# Altium project DIOT_template.PrjPCB (part 1 of 2)
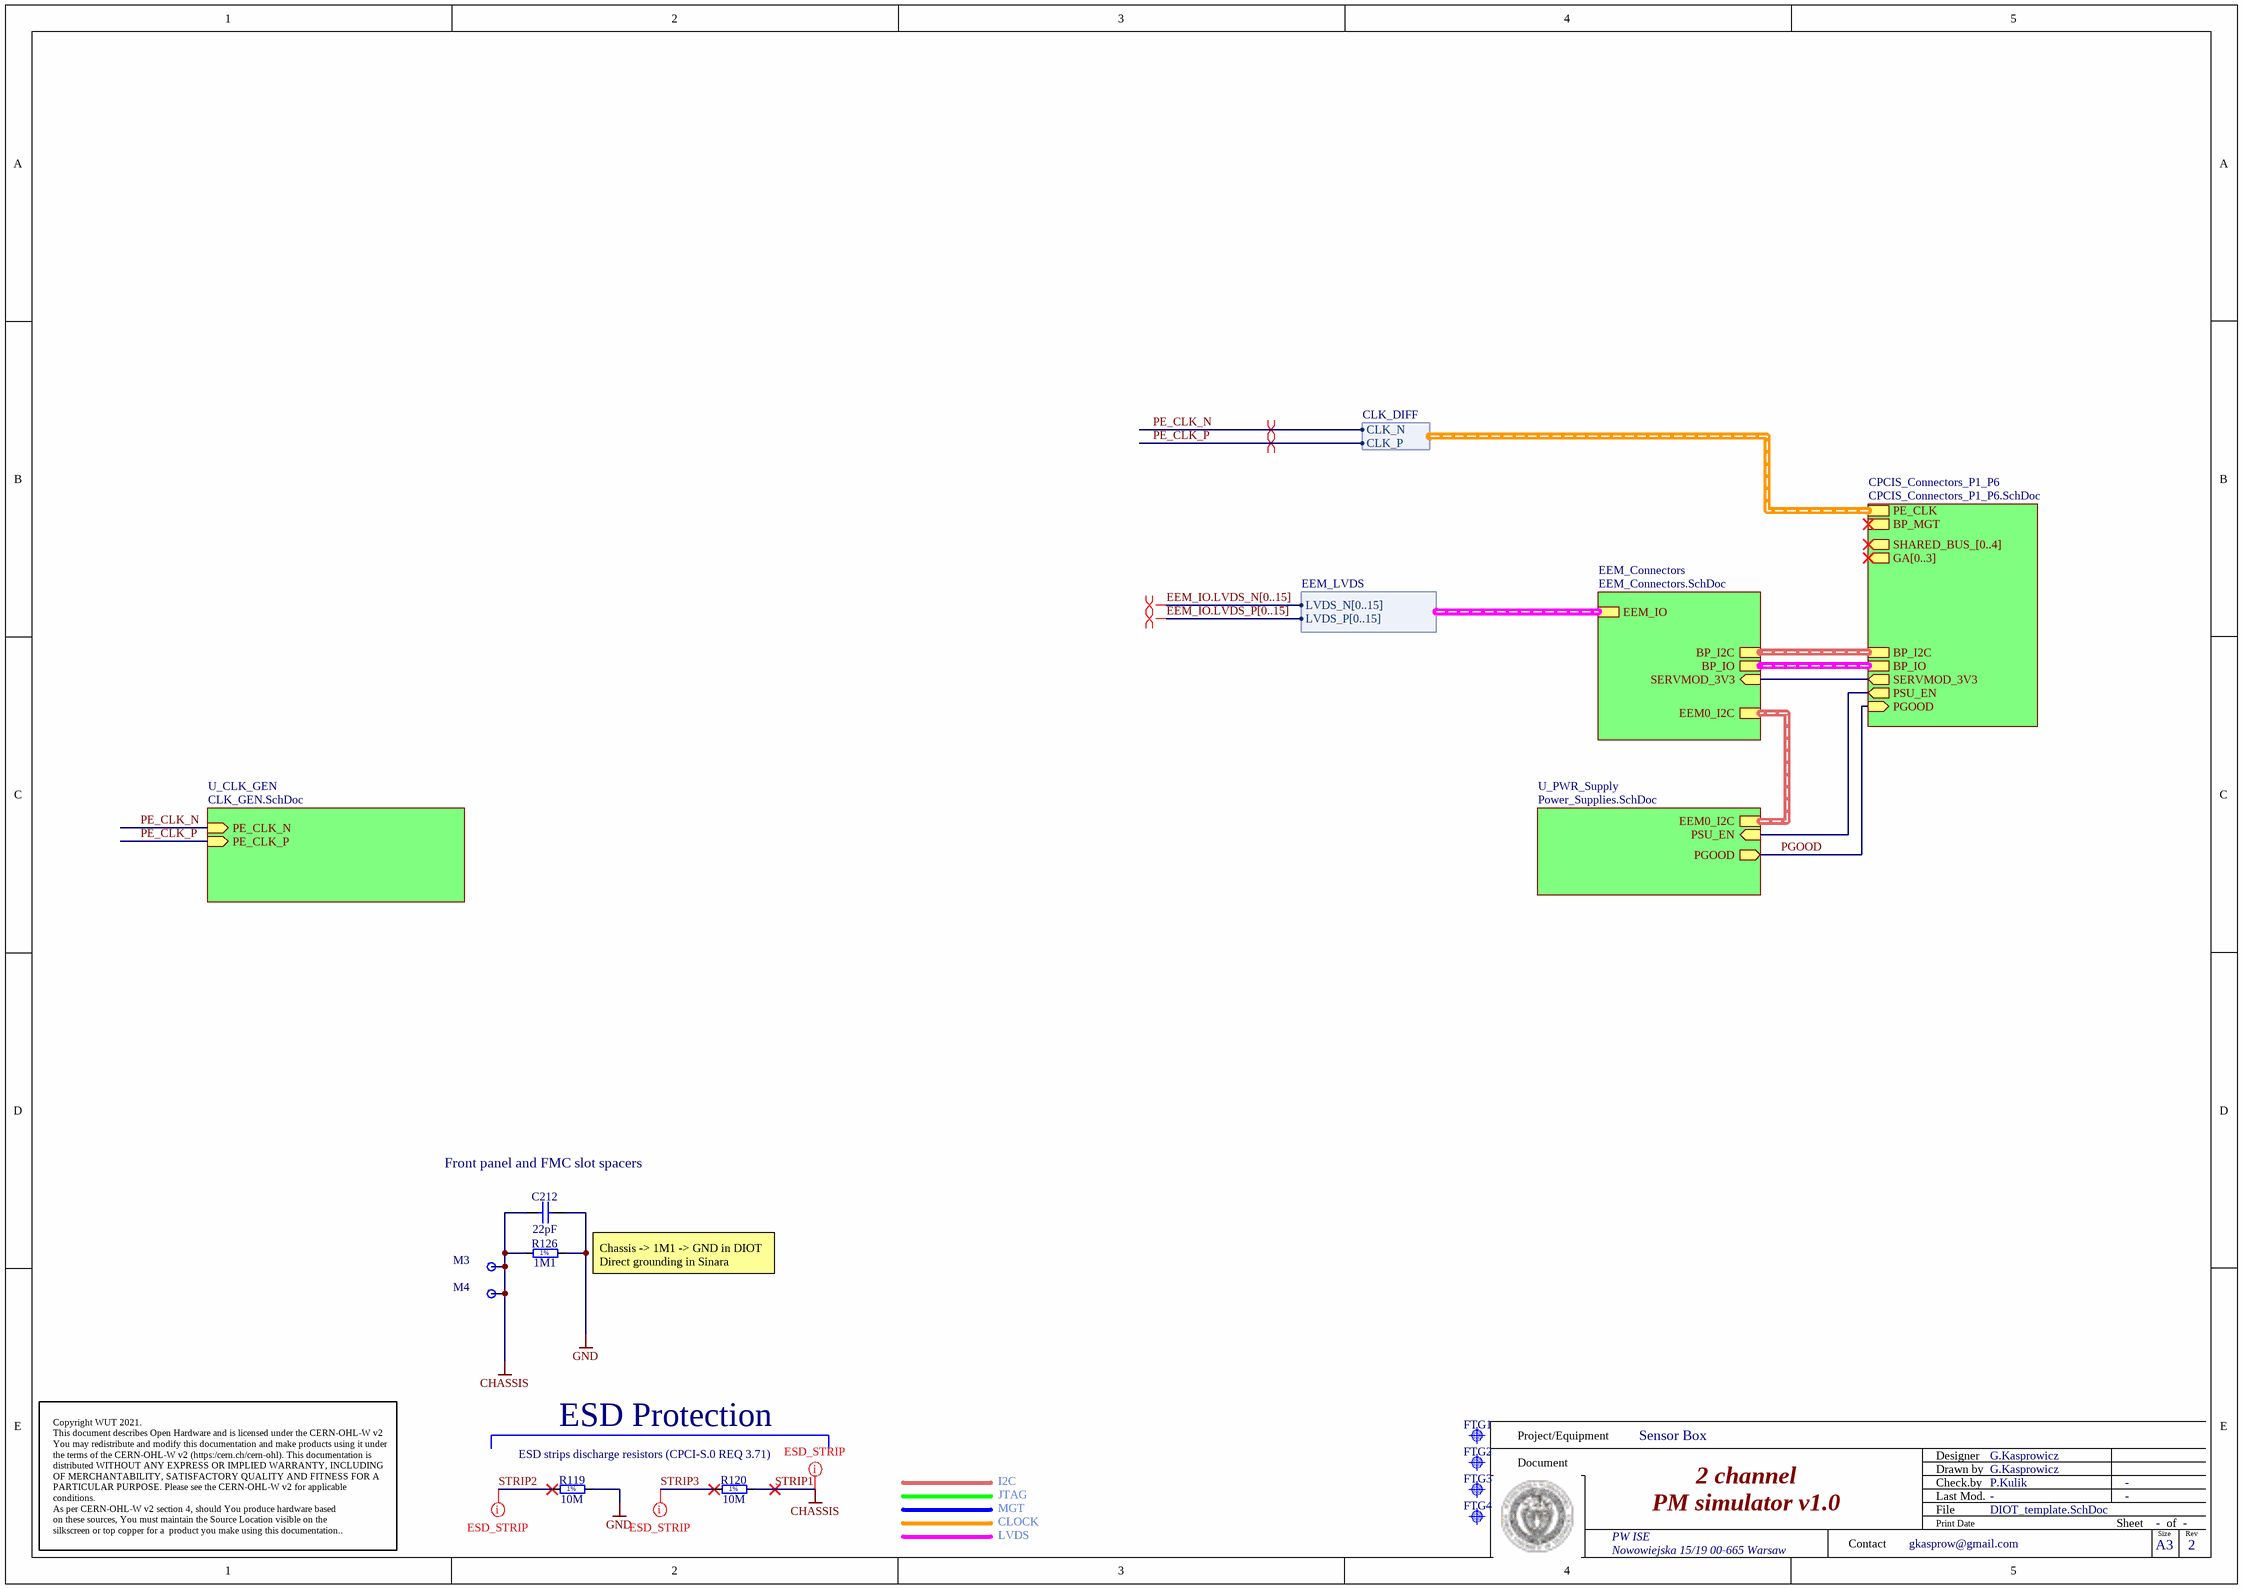
[diagram p0: DIOT_template.SchDoc]
Version: 1.1; Title: EEM FMC Carrier; SheetTotal: 12; P_version: 1.1; Projet: ARTIQ/Sinara; Project1: EEM FMC Carrier; DrawnBy: Paweł Kulik; DivGrp: ISE; Designer: Paweł Kulik; CheckedDate: -; CheckedBy: -; Address3: pawel.kulik@pw.edu.pl; Address2: Nowowiejska 15/19 00-665 Warsaw; Address1: Warsaw University of Technology
4 sheets, 146 parts. Net scope: hierarchical (ports join the sheet entries above them; power ports are global).
Board file: DIOT_template.PcbDoc
Sheets:
  DIOT_template.SchDoc
    U_PWR_Supply = Power_Supplies.SchDoc
    CPCIS_Connectors_P1_P6 = CPCIS_Connectors_P1_P6.SchDoc
    EEM_Connectors = EEM_Connectors.SchDoc

## Sheet DIOT_template.SchDoc: 2 channel
size 420 x 297 mm; EDA_Number: ARTIQ; Projet: ARTIQ/Sinara; CheckedBy: P.Kulik; Author: G.Kasprowicz; CompanyName: WUT ISE; DrawnBy: G.Kasprowicz; Organization: WUT ISE; Address1: PW ISE; Address2: Nowowiejska 15/19 00-665 Warsaw; Address3: gkasprow@gmail.com; Revision: 2; SheetNumber: -; SheetTotal: -; ModifiedBy: -; CheckedDate: -; Title2: PM simulator v1.0; DivGrp: WUT ISE; Designer: G.Kasprowicz; ModifiedDate: -; ProjectName: Sensor Box

### Parts
C212  22pF  [CAPC1005X55N]
FTG1  Use only in PCB  [FIDUCIAL_TOP_C100-200]  (value not drawn)
FTG2  Use only in PCB  [FIDUCIAL_TOP_S100-200]  (value not drawn)
FTG3  Use only in PCB  [FIDUCIAL_TOP_S100-200]  (value not drawn)
FTG4  Use only in PCB  [FIDUCIAL_TOP_S100-200]  (value not drawn)
M3  Plated Hole  [MTG300_600]  (value not drawn)  (no BOM)
M4  Plated Hole  [MTG300_600]  (value not drawn)  (no BOM)
R119  10M  [RESC2113X55N]
R120  10M  [RESC2113X55N]
R126  1M1  [RESC2012X60N]

### Sub-sheets
CPCIS_Connectors_P1_P6 = CPCIS_Connectors_P1_P6.SchDoc: BP_I2C (harness I2C), SERVMOD_3V3 (out), PSU_EN (out), PE_CLK (harness CLK_DIFF), BP_MGT (harness MGT), GA[0..3] (out), BP_IO (harness EEM_LVDS), SHARED_BUS_[0..4] (out), PGOOD (in)
EEM_Connectors = EEM_Connectors.SchDoc: EEM_IO (harness EEM_LVDS), BP_IO (harness EEM_LVDS), EEM0_I2C (harness I2C), BP_I2C (harness I2C), SERVMOD_3V3 (in)
U_CLK_GEN = CLK_GEN.SchDoc (file not in this document): PE_CLK_N (in), PE_CLK_P (in)
U_PWR_Supply = Power_Supplies.SchDoc: PSU_EN (in), EEM0_I2C (harness I2C), PGOOD (out)

### Harnesses
EEM_LVDS: LVDS_P[0..15], LVDS_N[0..15]
CLK_DIFF: CLK_N, CLK_P

### Nets
GND: C212.2 R119.2 R126.2
STRIP1: C212.1 M3.1 M4.1 R120.2 R126.1  [also labelled CHASSIS]
PE_CLK_N: sheet U_CLK_GEN/PE_CLK_N, sheet CPCIS_Connectors_P1_P6/PE_CLK.CLK_N  [project net PE_CLK.CLK_N]
PE_CLK_P: sheet U_CLK_GEN/PE_CLK_P, sheet CPCIS_Connectors_P1_P6/PE_CLK.CLK_P  [project net PE_CLK.CLK_P]
PGOOD: sheet U_PWR_Supply/PGOOD, sheet CPCIS_Connectors_P1_P6/PGOOD
PSU_EN: sheet U_PWR_Supply/PSU_EN, sheet CPCIS_Connectors_P1_P6/PSU_EN
SERVMOD_3V3: sheet CPCIS_Connectors_P1_P6/SERVMOD_3V3, sheet EEM_Connectors/SERVMOD_3V3
STRIP2: R119.1
STRIP3: R120.1

### Buses and harness runs
bus EEM_IO.LVDS_N[0..15]
bus EEM_IO.LVDS_P[0..15]
harness sheet CPCIS_Connectors_P1_P6/BP_I2C = sheet EEM_Connectors/BP_I2C
harness sheet CPCIS_Connectors_P1_P6/BP_IO = sheet EEM_Connectors/BP_IO
harness sheet EEM_Connectors/EEM0_I2C = sheet U_PWR_Supply/EEM0_I2C

### Layout directives
net class ESD_STRIP: STRIP1, STRIP2, STRIP3
differential pair; differential pair class Diff_100Ohm: (no net found under the mark), PE_CLK.CLK_N, PE_CLK.CLK_P

### Notes on the sheet
- (near C212) Front panel and FMC slot spacers
- Chassis -> 1M1 -> GND in DIOT
  Direct grounding in Sinara
- ESD strips discharge resistors (CPCI-S.0 REQ 3.71)
- ESD Protection
- I2C
- JTAG
- MGT
- CLOCK
- LVDS
- Project/Equipment
- Document
- Designer
- Drawn by
- Check.by
- Contact
- File
- Last Mod.
- Print Date
- Sheet
- Size
- A3
- of
- Rev
- Copyright WUT 2021.
  This document describes Open Hardware and is licensed under the CERN-OHL-W v2
  You may redistribute and modify this documentation and make products using it under the terms of the CERN-OHL-W v2 (https:/cern.ch/cern-ohl). This documentation is distributed WITHOUT ANY EXPRESS OR IMPLIED WARRANTY, INCLUDING OF MERCHANTABILITY, SATISFACTORY QUALITY AND FITNESS FOR A PARTICULAR PURPOSE. Please see the CERN-OHL-W v2 for applicable conditions.
  As per CERN-OHL-W v2 section 4, should You produce hardware based
  on these sources, You must maintain the Source Location visible on the
  silkscreen or top copper for a  product you make using this documentation..
- (in symbol R0805_1M1_1%_0.125W_100PPM) 1%
- (in symbol R0805_10M_1%_0.125W_100PPM_VISHAY_CRCW e3) 1%

### Library data of the parts
C212 = CC0402_22PF_50V_5%_C0G: Non-polarised capacitor; Part Description: SMD Multilayer Chip Ceramic Capacitor; Manufacturer: GENERIC; Manufacturer1 Part Number: C0402C220J5GACTU; Voltage: 50V; TC: C0G/NP0; Tolerance: ±5%; Part Number: CC0402_22PF_50V_5%_C0G; Component Kind: Standard; Component Type: Standard; Pin Count: 2; Value: 22pF; Status: Preferred; Manufacturer Part Number: CC0402_22PF_50V_5%_C0G; Case: 0402; Mounted: Yes; Socket: No; SMD: Yes; Manufacturer1 Example: KEMET; Manufacturer1 ComponentHeight: 0.55mm; HelpURL: \\cern.ch\dfs\Applications\Altium\Datasheets\CC0402_C0G_KEMET_(Commercial Grade).pdf; Author: CERN DEM JLC; CreateDate: 2007-12-03; LatestRevisionDate: 2007-12-03; Sense: No
FTG1 = FIDUCIAL_TARGET_C100-200: Fiducial Target; Part Description: Round Fiducial Target, Top Layer, 1.0mm, Top Solder 2.0mm, Keepout =2.0mm; Mounted: No; Part Number: FIDUCIAL_TARGET_C100-200; Component Kind: Standard (No BOM); Component Type: Standard (No BOM); Pin Count: 1; Family: Fiducial; Socket: No; SMD: Yes; Sense: No; Status: None; ComponentHeight: 0mm; HelpURL: Undefined; Author: CERN DEM JLC; CreateDate: 09.02.2010; LatestRevisionDate: 04.04.2012; PackageDescription: Round Fiducial Target, Top Layer, 1.0mm, Top Solder 2.0mm, Keepout =2.0mm
FTG2-FTG4 = FIDUCIAL_TARGET_S100-200: Fiducial Target; Part Description: Square Fiducial Target, Top Layer, 1.0mm, Top Solder 2.0mm, Keepout =2.0mm; Mounted: No; Part Number: FIDUCIAL_TARGET_S100-200; Component Kind: Standard (No BOM); Component Type: Standard (No BOM); Pin Count: 1; Family: Fiducial; Socket: No; SMD: Yes; Sense: No; Status: None; ComponentHeight: 0mm; HelpURL: Undefined; Author: CERN DEM JLC; CreateDate: 09.02.2010; LatestRevisionDate: 04.04.2012; PackageDescription: Square Fiducial Target, Top Layer, 1.0mm, Top Solder 2.0mm, Keepout =2.0mm
M3 M4 = PLATED_HOLE3.0_PAD6.0: Single Terminal Socket; Part Description: Plated Through Hole: Hole Dia.=3.0mm Pad Dia.=6.0mm; Mounted: No; Table: Pads; Part Number: PLATED_HOLE3.0_PAD6.0; Component Type: Standard (No BOM); Designator: Single Terminal Socket; Library Reference: Single Terminal Socket; Pin Count: 1; Family: Plated Hole; Socket: No; SMD: No; Status: None; ComponentHeight: 0mm; Author: CERN DEM JLC; CreateDate: 26.05.2008; LatestRevisionDate: 26.05.2008; PackageDescription: Plated Through Hole: Hole Dia.=3.0mm Pad Dia.=6.0mm
R119 R120 = R0805_10M_1%_0.125W_100PPM_VISHAY_CRCW e3: Resistor - 1%; Part Description: 150V, Standard Thick Film Chip Resistor; Manufacturer: VISHAY DALE; Manufacturer Part Number: CRCW080510M0FKEA; Power: 0.125W; TC: ±100ppm/°C; PressFit: No; Part Number: R0805_10M_1%_0.125W_100PPM_VISHAY_CRCW e3; Component Kind: Standard; Component Type: Standard; Pin Count: 2; Value: 10M; Status: None; Tolerance: ±1%; Case: 0805; Mounted: Yes; Sense: No; Socket: No; SMD: Yes; ComponentHeight: 0.5mm; HelpURL: \\cern.ch\dfs\Applications\Altium\Datasheets\R0805_VISHAY_CRCW e3.pdf; Author: CERN DEM BC; CreateDate: 2019-11-12; LatestRevisionDate: 2019-11-12
R126 = R0805_1M1_1%_0.125W_100PPM: Resistor - 1%; Part Description: General Purpose Thick Film Chip Resistor; Manufacturer: GENERIC; Manufacturer1 Part Number: NRC10F1104TRF; PressFit: No; Part Number: R0805_1M1_1%_0.125W_100PPM; Component Kind: Standard; Component Type: Standard; Pin Count: 2; Value: 1M1; Status: Preferred; Manufacturer Part Number: R0805_1M1_1%_0.125W_100PPM; Case: 0805; Mounted: Yes; Sense: No; Socket: No; SMD: Yes; Manufacturer1 Example: NIC COMPONENT; Manufacturer1 ComponentHeight: 0.6mm; HelpURL: \\cern.ch\dfs\Applications\Altium\Datasheets\R0805_NIC_NRC.pdf; Author: CERN DEM JLC; CreateDate: 03/12/2007; LatestRevisionDate: 13/03/2008

## Sheet Power_Supplies.SchDoc: Power supply
size 420 x 297 mm; EDA_Number: ARTIQ; Projet: ARTIQ/Sinara; CheckedBy: P.Kulik; Author: G.Kasprowicz; CompanyName: WUT ISE; DrawnBy: G.Kasprowicz; Organization: WUT ISE; Address1: PW ISE; Address2: Nowowiejska 15/19 00-665 Warsaw; Address3: gkasprow@gmail.com; Revision: 2; SheetNumber: -; SheetTotal: -; ModifiedBy: -; CheckedDate: -; DivGrp: WUT ISE; Designer: G.Kasprowicz; ModifiedDate: -; ProjectName: Sensor Box
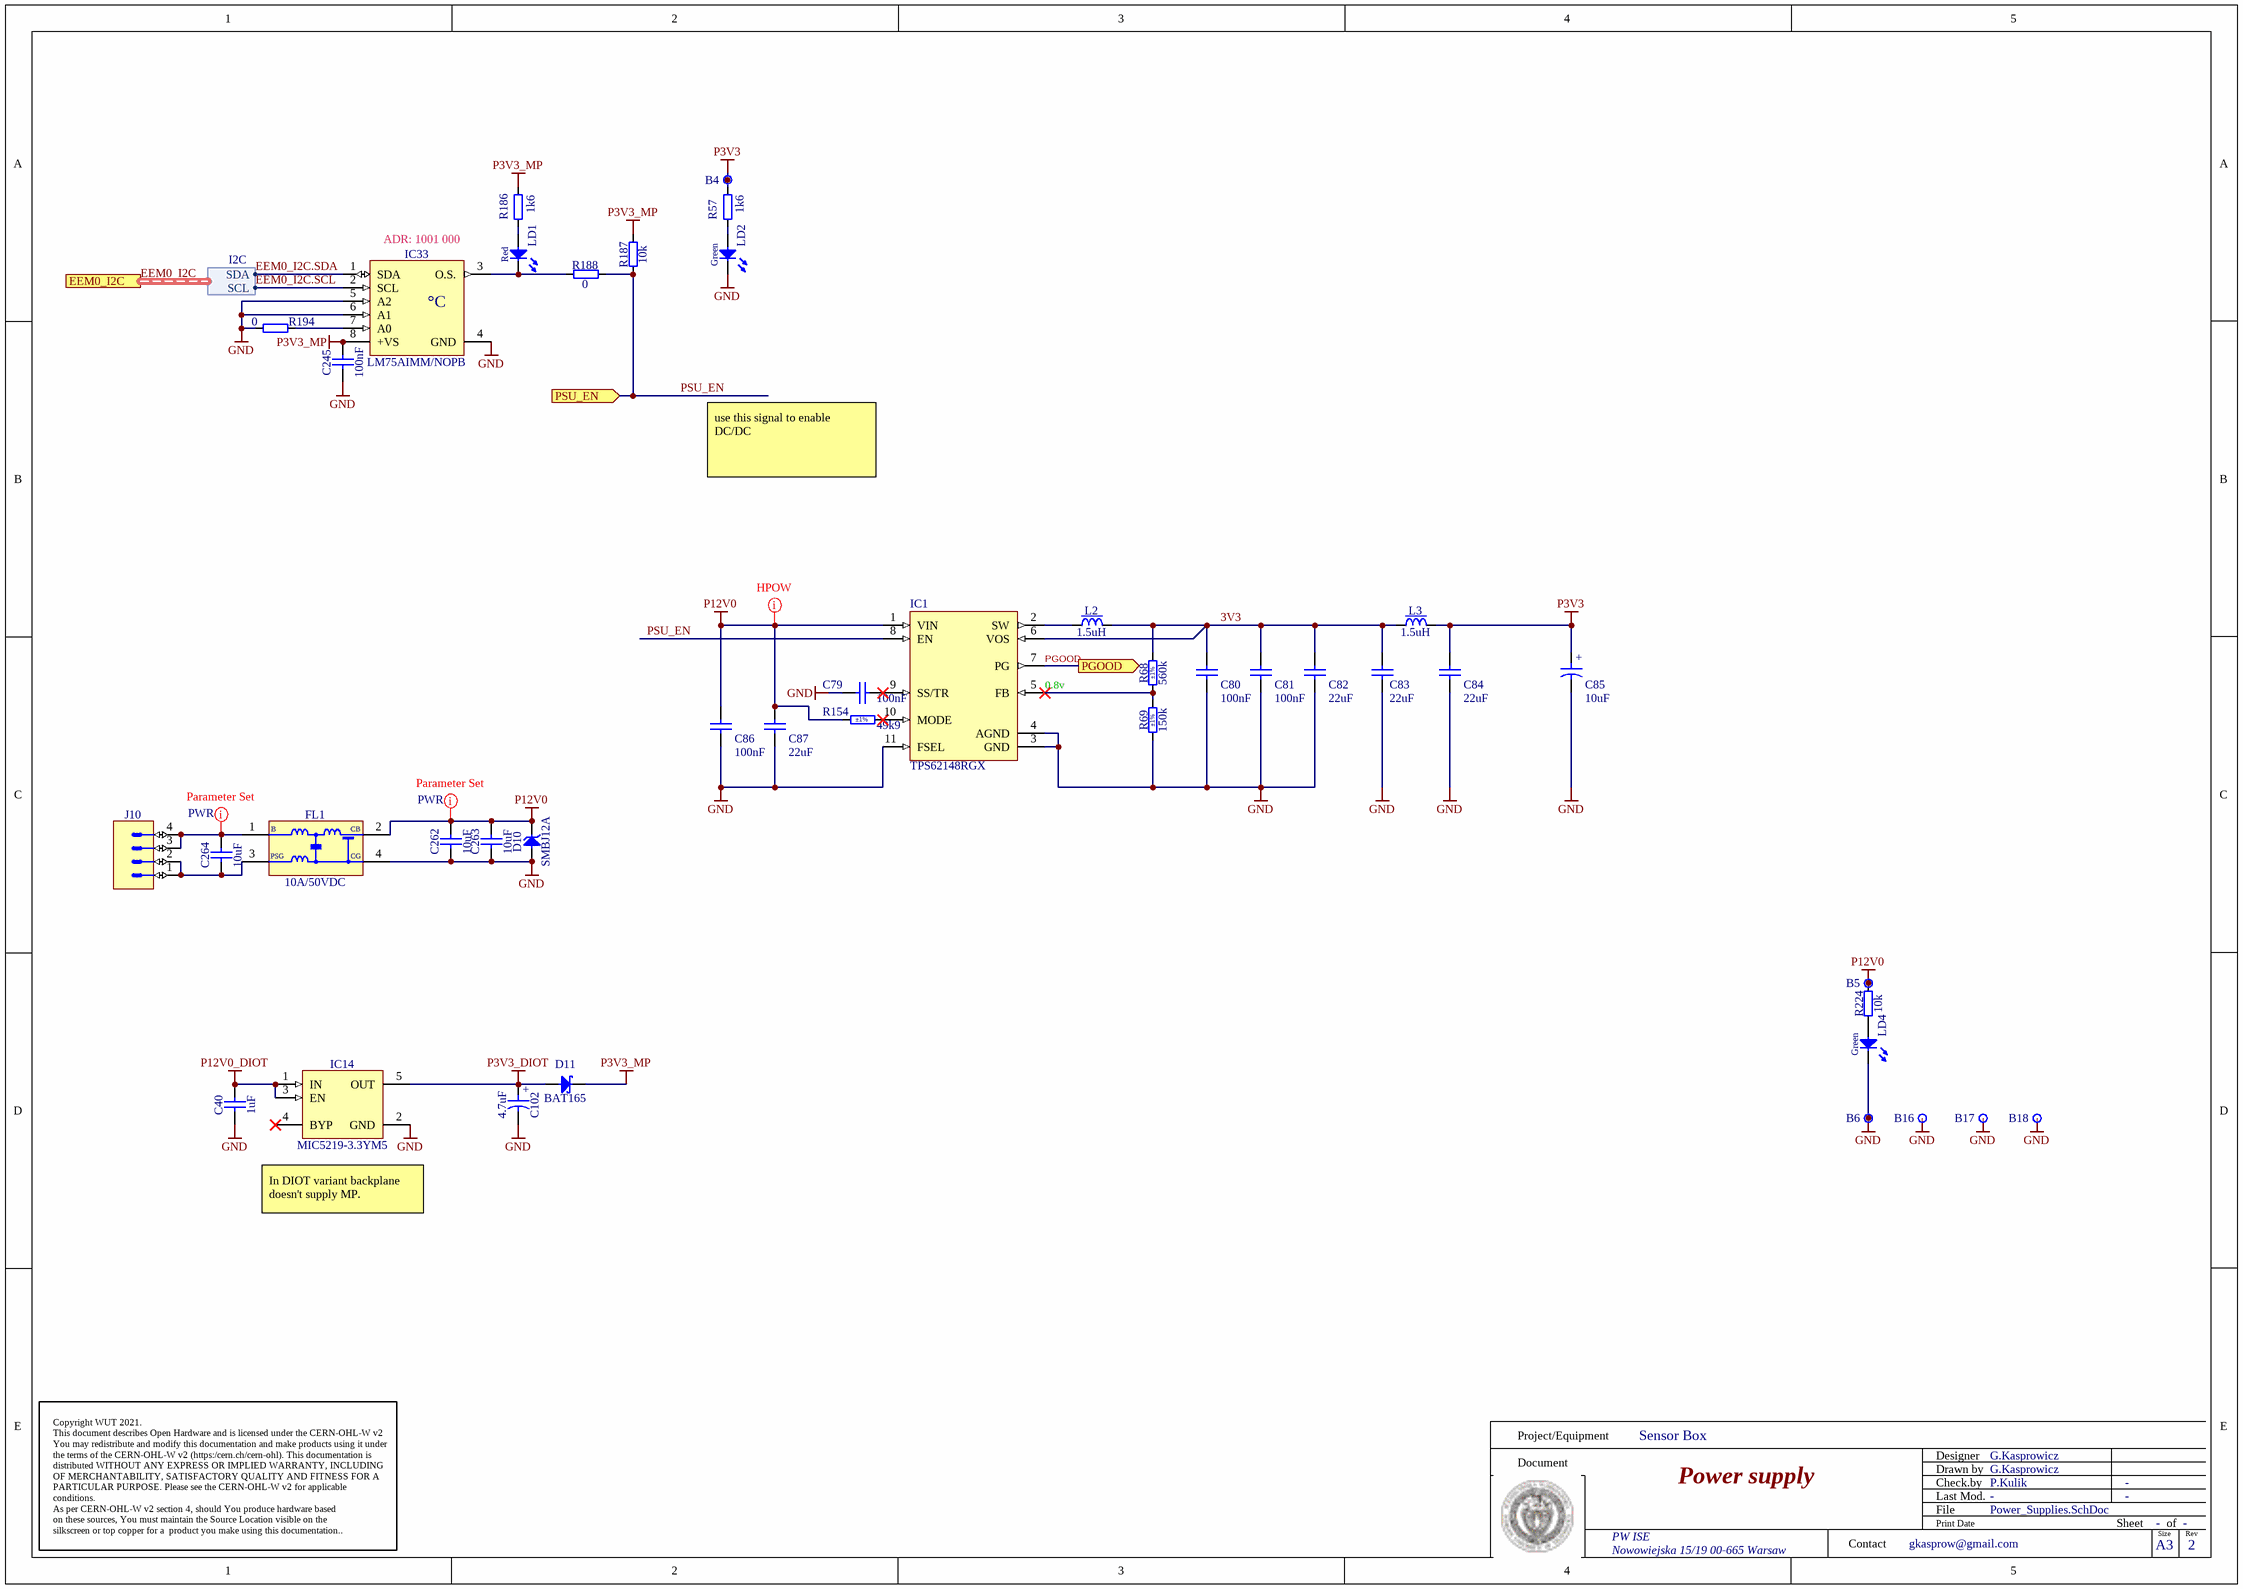
[diagram p1: Power_Supplies.SchDoc]

### Parts
B4  Plated Hole  [c150h50]  (value not drawn)  (no BOM)
B5  Plated Hole  [c150h50]  (value not drawn)  (no BOM)
B6  Plated Hole  [c150h50]  (value not drawn)  (no BOM)
B16  Plated Hole  [c150h50]  (value not drawn)  (no BOM)
B17  Plated Hole  [c150h50]  (value not drawn)  (no BOM)
B18  Plated Hole  [c150h50]  (value not drawn)  (no BOM)
C40  1uF  [CAPC1608X87N]
C79  100nF  [CAPC1005X55N]
C80  100nF  [CAPC1005X55N]
C81  100nF  [CAPC1005X55N]
C82  22uF  [CAPC2012X135N]
C83  22uF  [CAPC2012X135N]
C84  22uF  [CAPC2012X135N]
C85  10uF  [CAPMP3216X180N]
C86  100nF  [CAPC1005X55N]
C87  22uF  [CAPC2012X135N]
C102  4.7uF  [CAPMP3216X180N]
C245  100nF  [CAPC1005X55N]
C262  10uF  [CAPC2012X95N]
C263  10uF  [CAPC2012X95N]
C264  10uF  [CAPC2012X95N]
D10  SMBJ12A  [DIOM5336X265N]
D11  BAT165  [SOD2512X110N]
FL1  10A/50VDC  [FIL_MURATA_BNX02]
IC1  TPS62148RGX  [TEXAS_RGX0011A]
IC14  MIC5219-3.3YM5  [SOT95P280X145-5N]
IC33  LM75AIMM/NOPB  [SOP65P490X109-8N]
J10  Mini-Fit Jr.™  [MOLEX_39-30-0040]  (value not drawn)
L2  1.5uH  [IND_WURTH_WE-LHMI_7050]
L3  1.5uH  [IND_WURTH_WE-LHMI_7050]
LD1  Red  [LED_AVAGO_HSMC-C110]
LD2  Green  [LED_AVAGO_HSME-C110]
LD4  Green  [LED_AVAGO_HSME-C110]
R57  1k6  [RESC1005X40N]
R68  560k  Tolerance: ±1%  [RESC1608X55N]
R69  150k  Tolerance: ±1%  [RESC1608X55N]
R154  49k9  Tolerance: ±1%  [RESC1608X55N]
R186  1k6  [RESC1005X40N]
R187  10k  [RESC1608X55N]
R188  0  [RESC1005X40N]
R194  0  [RESC1005X40N]
R224  10k  [RESC1608X55N]

### Ports
EEM0_I2C (harness I2C), PGOOD (out), PSU_EN (in)

### Harnesses
I2C: SDA, SCL

### Nets
GND: B6.1 B16.1 B17.1 B18.1 C40.1 C79.1 C80.1 C81.1 C82.1 C83.1 C84.1 C85.2 C86.1 C87.1 C102.2 C245.1 C262.1 C263.1 D10.2(A) FL1.4(CG) IC1.3(GND) IC1.4(AGND) IC1.11(FSEL) IC14.2(GND) IC33.4(GND) IC33.5(A2) IC33.6(A1) LD2.1(C) LD4.1(C) R69.1 R194.1
P3V3: B4.1 C84.2 C85.1 L3.2 R57.2
P3V3_DIOT: C102.1 D11.2(A) IC14.5(OUT)
P3V3_MP: C245.2 D11.1(C) IC33.8(+VS) R186.2 R187.2
P12V0: B5.1 C86.2 C87.2 C262.2 C263.2 D10.1(C) FL1.2(CB) IC1.1(VIN) R154.1 R224.2
P12V0_DIOT: C40.2 IC14.1(IN) IC14.3(EN)
3V3: C80.2 C81.2 C82.2 C83.2 IC1.6(VOS) L2.2 L3.1 R68.2
EEM0_I2C.SCL: IC33.2(SCL) ; port EEM0_I2C.SCL
EEM0_I2C.SDA: IC33.1(SDA) ; port EEM0_I2C.SDA
PGOOD: IC1.7(PG) ; port PGOOD
PSU_EN: IC1.8(EN) R187.1 R188.2 ; port PSU_EN
NetC79_2: C79.2 IC1.9(SS/TR)
NetC264_1: C264.1 FL1.3(PSG) J10.1 J10.2
NetC264_2: C264.2 FL1.1(B) J10.3 J10.4
NetIC1_2: IC1.2(SW) L2.1
NetIC1_5: IC1.5(FB) R68.1 R69.2
NetIC1_10: IC1.10(MODE) R154.2
NetIC33_3: IC33.3(O.S.) LD1.1(C) R188.1
NetIC33_7: IC33.7(A0) R194.2
NetLD1_2: LD1.2(A) R186.1
NetLD2_2: LD2.2(A) R57.1
NetLD4_2: LD4.2(A) R224.1

Not connected (* = marked no-connect by the designer): IC14 4(BYP)*

### Buses and harness runs
harness EEM0_I2C = port EEM0_I2C

### Layout directives
net class PWR: NetC264_2, P12V0
net class HPOW: P12V0

### Notes on the sheet
- (near IC33) ADR: 1001 000
- use this signal to enable DC/DC
- (near IC1) 0.8v
- In DIOT variant backplane doesn't supply MP.
- Project/Equipment
- Document
- Designer
- Drawn by
- Check.by
- Contact
- File
- Last Mod.
- Print Date
- Sheet
- Size
- A3
- of
- Rev
- Copyright WUT 2021.
  This document describes Open Hardware and is licensed under the CERN-OHL-W v2
  You may redistribute and modify this documentation and make products using it under the terms of the CERN-OHL-W v2 (https:/cern.ch/cern-ohl). This documentation is distributed WITHOUT ANY EXPRESS OR IMPLIED WARRANTY, INCLUDING OF MERCHANTABILITY, SATISFACTORY QUALITY AND FITNESS FOR A PARTICULAR PURPOSE. Please see the CERN-OHL-W v2 for applicable conditions.
  As per CERN-OHL-W v2 section 4, should You produce hardware based
  on these sources, You must maintain the Source Location visible on the
  silkscreen or top copper for a  product you make using this documentation..
- (in symbol CTE3216-18_4.7UF_10V_10%_AVX_TPSA475K010T1400) +
- (in symbol CTE3216-18_10UF_16V_20%_AVX_TCJ) +
- (in symbol LM75AIMM/NOPB) °C

### Library data of the parts
B4-B6 B16-B18 = PLATED_HOLE0.5_PAD1.5: Single Terminal Socket; Part Description: Plated Through Hole: Hole Dia.=0.5mm Pad Dia.=1.5mm; Mounted: No; Part Number: PLATED_HOLE0.5_PAD1.5; Component Type: Standard (No BOM); Pin Count: 1; Family: Plated Hole; Socket: No; SMD: No; Sense: No; Status: None; ComponentHeight: 0mm; HelpURL: Undefined; Author: CERN DEM MR; CreateDate: 12.10.2017; LatestRevisionDate: 12.10.2017; PackageDescription: Plated Through Hole: Hole Dia.=0.5mm Pad Dia.=1.5mm
C40 = CC0603_1UF_25V_10%_X7R: Non-polarised capacitor; Part Description: SMD Multilayer Chip Ceramic Capacitor; Manufacturer: GENERIC; Manufacturer1 Part Number: GRM188R71E105KA12D; Voltage: 25V; TC: X7R; Tolerance: ±10%; Part Number: CC0603_1UF_25V_10%_X7R; Component Kind: Standard; Component Type: Standard; Pin Count: 2; Value: 1uF; Status: None; Manufacturer Part Number: CC0603_1UF_25V_10%_X7R; Case: 0603; Mounted: Yes; Socket: No; SMD: Yes; Sense: No; Manufacturer1 Example: MURATA; Manufacturer1 ComponentHeight: 0.9mm; HelpURL: \\cern.ch\dfs\Applications\Altium\Datasheets\CC0603_X7R_MURATA.pdf; Author: CERN DEM JLC; CreateDate: 18.01.2011; LatestRevisionDate: 18.01.2011
C79-C81 C86 C245 = CC0402_100NF_50V_10%_X7R: Non-polarised capacitor; Part Description: SMD Multilayer Chip Ceramic Capacitor; Manufacturer: GENERIC; Manufacturer1 Part Number: GRM155R71H104KE14D; Voltage: 50V; TC: X7R; Tolerance: ±10%; Part Number: CC0402_100NF_50V_10%_X7R; Component Kind: Standard; Component Type: Standard; Pin Count: 2; Value: 100nF; Status: None; Manufacturer Part Number: CC0402_100NF_50V_10%_X7R; Case: 0402; Mounted: Yes; Socket: No; SMD: Yes; Sense: No; Manufacturer1 Example: MURATA; Manufacturer1 ComponentHeight: 0.55mm; HelpURL: \\cern.ch\dfs\Applications\Altium\Datasheets\CC0402_MURATA_GRM155R71H104KE14D.pdf; Author: CERN DEM MR; CreateDate: 30.06.2017; LatestRevisionDate: 30.06.2017
C82-C84 C87 = CC0805_22UF_16V_10%_X5R: Non-polarised capacitor; Part Description: SMD Multilayer Chip Ceramic Capacitor; Manufacturer: GENERIC; Manufacturer1 Part Number: C2012X5R1C226KT; Voltage: 16V; TC: X5R; Tolerance: ±10%; Part Number: CC0805_22UF_16V_10%_X5R; Component Kind: Standard; Component Type: Standard; Pin Count: 2; Value: 22uF; Status: Preferred; Manufacturer Part Number: CC0805_22UF_16V_10%_X5R; Case: 0805; Mounted: Yes; Socket: No; SMD: Yes; Sense: No; Manufacturer1 Example: TDK; Manufacturer1 ComponentHeight: 1.35mm; HelpURL: \\cern.ch\dfs\Applications\Altium\Datasheets\CC0805_X5R_TDK_C.pdf; Author: CERN DEM JLC; CreateDate: 25.10.2012; LatestRevisionDate: 25.10.2012
C85 = CTE3216-18_10UF_16V_20%_AVX_TCJ: Polarised capacitor; Part Description: ESR 0R200 Tantalum Solid Electrolytic Chip Capacitor with Conductive Polymer Electrode; Manufacturer: AVX; Manufacturer Part Number: TCJA106M016R0200; Voltage: 16V; Tolerance: ±20%; Part Number: CTE3216-18_10UF_16V_20%_AVX_TCJ; Component Kind: Standard; Component Type: Standard; Pin Count: 2; Value: 10uF; Status: Preferred; Case: A; Mounted: Yes; Socket: No; SMD: Yes; Sense: No; ComponentHeight: 1.8mm; HelpURL: \\cern.ch\dfs\Applications\Altium\Datasheets\CTE_AVX_TCJ.pdf; Author: CERN DEM JLC; CreateDate: 29.03.2012; LatestRevisionDate: 29.03.2012
C102 = CTE3216-18_4.7UF_10V_10%_AVX_TPSA475K010T1400: Polarised capacitor; Part Description: Low ESR 1R4 Automotive Solid Tantalum Chip Capacitor; Manufacturer: AVX; Voltage: 10V; Tolerance: ±10%; Part Number: CTE3216-18_4.7UF_10V_10%_AVX_TPSA475K010T1400; Component Kind: Standard; Component Type: Standard; Pin Count: 2; Value: 4.7uF; Status: Preferred; Manufacturer Part Number: TPSA475K010T1400; Case: A; Mounted: Yes; Socket: No; SMD: Yes; Sense: No; ComponentHeight: 1.8mm; HelpURL: \\cern.ch\dfs\Applications\Altium\Datasheets\CTE-LESR_AVX_TPS-AUTO.pdf; Author: CERN DEM JLC; CreateDate: 23.01.2018; LatestRevisionDate: 23.01.2018
C262-C264 = CC0805_10UF_25V_10%_X5R: Non-polarised capacitor; Part Description: SMD Multilayer Chip Ceramic Capacitor; Manufacturer: GENERIC; Manufacturer1 Part Number: GRM219R61E106KA12D; Voltage: 25V; TC: X5R; Tolerance: ±10%; Part Number: CC0805_10UF_25V_10%_X5R; Component Kind: Standard; Component Type: Standard; Pin Count: 2; Value: 10uF; Status: Preferred; Manufacturer Part Number: CC0805_10UF_25V_10%_X5R; Case: 0805; Mounted: Yes; Socket: No; SMD: Yes; Sense: No; Manufacturer1 Example: MURATA; Manufacturer1 ComponentHeight: 0.95mm; HelpURL: \\cern.ch\dfs\Applications\Altium\Datasheets\CC0805_X5R_MURATA_GRM.pdf; Author: CERN DEM JLC; CreateDate: 25.10.2012; LatestRevisionDate: 06.09.2016
D10 = SMBJ12A: Zener Diode; Part Description: Uni-Directional Transient Voltage Suppressor Diode; Manufacturer: FAIRCHILD SEMICONDUCTOR; Voltage: 12V; Power: 600W; PressFit: No; Bonding: No; Part Number: SMBJ12A; Component Kind: Standard; Component Type: Standard; Device: SMBJ12A; PackageDescription: DO-214-AA/SMB Diode, Molded Body; 5.34mm L X 3.625mm W X 2.65mm H, IPC Medium Density; Manufacturer Part Number: SMBJ12A; Pin Count: 2; Case: DO-214AA; Mounted: Yes; Socket: No; SMD: Yes; Sense: No; ComponentHeight: 2.65mm; HelpURL: \\cern.ch\dfs\Applications\Altium\Datasheets\SMBJ.pdf; Author: CERN DEM JLC; CreateDate: 10.04.2013; LatestRevisionDate: 10.04.2013
D11 = BAT165: Schottky Diode; Manufacturer: INFINEON; Part Description: Medium Power AF Schottky Diode; Voltage: 40V; Power: 750mA; PressFit: No; Bonding: No; Manufacturer Part Number: BAT165; PackageDescription: Small Outline Diode (SOD-323), 1.70mm W X 1.25mm L X 1.10mm H body,  IPC Medium Density; Part Number: BAT165; Component Kind: Standard; Component Type: Standard; Device: BAT165; Pin Count: 2; Case: SOD323; Mounted: Yes; Socket: No; SMD: Yes; Sense: No; ComponentHeight: 1.1mm; HelpURL: \\cern.ch\dfs\Applications\Altium\Datasheets\BAT165.pdf; Author: CERN DEM JLC; CreateDate: 12.11.2014; LatestRevisionDate: 12.11.2014
FL1 = FIL_MURATA_BNX022-01L: Block Type EMIFIL (LC Combined); Part Description: Block Type EMIFIL (LC Combined) SMD Type, BNX02* Series; Manufacturer: MURATA; Resistance: 0.5R; Part Number: FIL_MURATA_BNX022-01L; Component Kind: Standard; Component Type: Standard; Pin Count: 2; Value: 10A/50VDC; Status: None; Manufacturer Part Number: BNX022-01L; Mounted: Yes; Socket: No; SMD: Yes; Sense: No; ComponentHeight: 3.3mm; HelpURL: \\cern.ch\dfs\Applications\Altium\Datasheets\FIL_MURATA_BNX022-01L.pdf; Author: CERN DEM JLC; CreateDate: 10.10.2012; LatestRevisionDate: 10.10.2012
IC1 = TPS62148RGX: 3V-17V 2A Step-Down Converter, High Accuracy, With DCS-Control; Manufacturer: TEXAS INSTRUMENTS; PressFit: No; Bonding: No; Part Number: TPS62148RGX; Component Kind: Standard; Component Type: Standard; Device: TPS62148RGX; PackageDescription: TEXAS Case Style (R-VQFN-HR-N11), 0.50mm Pitch, 11 Pin, 2.00mm W X 3.00mm L X 1.00mm H body; Part Description: 3V-17V 2A Step-Down Converter, High Accuracy, with DCS-Control; Manufacturer Part Number: TPS62148RGX; Pin Count: 11; Case: QFN14; Mounted: Yes; Socket: No; SMD: Yes; Sense: No; ComponentHeight: 1mm; HelpURL: \\cern.ch\dfs\Applications\Altium\Datasheets\TPS62148RGX.pdf; Author: CERN DEM MR; CreateDate: 08.02.2019; LatestRevisionDate: 08.02.2019
IC14 = MIC5219-3.3YM5: 500mA Peak Output LDO Regulator; Part Description: 3.3V 500mA Peak Output Low Drop-Out  (LDO) Regulator; Manufacturer: MICROCHIP TECHNOLOGY; PressFit: No; Bonding: No; Part Number: MIC5219-3.3YM5; Component Kind: Standard; Component Type: Standard; Device: MIC5219-3.3YM5; PackageDescription: SOT, 0.95mm pitch; 5 pin, 1.60mm W X 2.90mm L X 1.45mm H body, IPC Medium Density; Manufacturer Part Number: MIC5219-3.3YM5; Pin Count: 5; Case: SOT23-5; Mounted: Yes; Socket: No; SMD: Yes; Sense: No; ComponentHeight: 1.45mm; HelpURL: \\cern.ch\dfs\Applications\Altium\Datasheets\MIC5219-3.3YM5.pdf; Author: CERN DEM WB; CreateDate: 2019-04-16; LatestRevisionDate: 2019-04-16
IC33 = LM75AIMM/NOPB: Digital Temperature Sensor and Thermal Watchdog with Two-Wire Interface; Part Description: -25° to +100°C ±2°C Digital Temperature Sensor and Thermal Watchdog with Two-Wire Interface; Manufacturer: TEXAS INSTRUMENTS; PressFit: No; Bonding: No; Part Number: LM75AIMM/NOPB; Component Kind: Standard; Component Type: Standard; Device: LM75AIMM/NOPB; PackageDescription: SOP, 0.65mm pitch; 8 pin,3.00mm W X 3.00mm L X 1.09mm H bodyI, PC Medium Density; Manufacturer Part Number: LM75AIMM/NOPB; Pin Count: 8; Case: SSOP8; Mounted: Yes; Socket: No; SMD: Yes; Sense: No; ComponentHeight: 1.09mm; HelpURL: \\cern.ch\dfs\Applications\Altium\Datasheets\LM75AIMM-NOPB.pdf; Author: CERN DEM JLC; CreateDate: 15.10.2012; LatestRevisionDate: 15.10.2012
J10 = MOLEX_39-30-0040: Connector 4 Male; Part Description: 4.20mm (.165") Pitch Mini-Fit Jr. Header, Dual Row, Right Angle with Snap-in Plastic Peg PCB Lock, 4 Circuits; Manufacturer: MOLEX; PressFit: No; Part Number: MOLEX_39-30-0040; Component Kind: Standard; Component Type: Standard; Pin Count: 4; Family: Mini-Fit Jr.™; Mounted: Yes; Socket: No; SMD: No; Sense: No; Status: None; Manufacturer Part Number: 39-30-0040; ComponentHeight: 11.4mm; HelpURL: \\cern.ch\dfs\Applications\Altium\Datasheets\MOLEX_39-30-0040.pdf; Author: CERN DEM JLC; CreateDate: 2018-10-02; LatestRevisionDate: 2018-10-02
L2 L3 = IND_1.5UH_20%_WURTH_WE-LHMI_74437349015: Inductor With Core; Part Description: SMD Power Inductor (WE-LHMI Series); Manufacturer: WURTH ELEKTRONIK; Power: 8A; Resistance: 0.0086R; Tolerance: ±20%; Part Number: IND_1.5UH_20%_WURTH_WE-LHMI_74437349015; Component Kind: Standard; Component Type: Standard; Pin Count: 2; Value: 1.5uH; Manufacturer Part Number: 74437349015; Mounted: Yes; Socket: No; SMD: Yes; Sense: No; ComponentHeight: 5mm; HelpURL: \\cern.ch\dfs\Applications\Altium\Datasheets\IND_WURTH_WE-LHMI_74437349015.pdf; Author: CERN DEM MR; CreateDate: 27.05.2016; LatestRevisionDate: 27.05.2016
LD1 = LED_AVAGO_HSMC-C110: LED Red 1C 2A; Part Description: High Performance Right Angle Chip Red LED; Manufacturer: AVAGO TECHNOLOGIES; PressFit: No; Bonding: No; Part Number: LED_AVAGO_HSMC-C110; Component Kind: Standard; Component Type: Standard; Color: Red; PackageDescription: Red Chip LED, 2-Leads, Body 3.3x1.6mm, Side Emitting Package; Status: Not Recommended; Manufacturer Part Number: HSMC-C110; Pin Count: 2; Case: 1206; Mounted: Yes; Socket: No; SMD: Yes; Sense: No; ComponentHeight: 1.1mm; HelpURL: \\cern.ch\dfs\Applications\Altium\Datasheets\LED_AVAGO_HSMC-C110.pdf; ComponentLink1URL: \\cern.ch\dfs\Applications\Altium\Datasheets\LED_AVAGO_HSMC-C110_DESIGN-GUIDE.pdf; ComponentLink1Description: Design Guide; Author: CERN DEM JMW; CreateDate: 30.07.2009; LatestRevisionDate: 20.06.2012
LD2 LD4 = LED_AVAGO_HSME-C110: LED Green 1C 2A; Part Description: High Performance Right Angle Chip Green LED; Manufacturer: AVAGO TECHNOLOGIES; PressFit: No; Bonding: No; Part Number: LED_AVAGO_HSME-C110; Component Kind: Standard; Component Type: Standard; Color: Green; PackageDescription: Green Chip LED, 2-Leads, Body 3.3x1.6mm, Side Emitting Package; Status: Not Recommended; Manufacturer Part Number: HSME-C110; Pin Count: 2; Case: 1206; Mounted: Yes; Socket: No; SMD: Yes; Sense: No; ComponentHeight: 1.1mm; HelpURL: \\cern.ch\dfs\Applications\Altium\Datasheets\LED_AVAGO_HSME-C110.pdf; ComponentLink1URL: \\cern.ch\dfs\Applications\Altium\Datasheets\LED_AVAGO_HSME-C110_DESIGN-GUIDE.pdf; ComponentLink1Description: Design Guide; Author: CERN DEM JMW; CreateDate: 30.07.2009; LatestRevisionDate: 20.06.2012
R57 R186 = R0402_1K6_1%_0.0625W_100PPM: Resistor - 1%; Part Description: General Purpose Thick Film Chip Resistor; Manufacturer: GENERIC; Manufacturer1 Part Number: 232270671602L; TC: ±100ppm/°C; PressFit: No; Part Number: R0402_1K6_1%_0.0625W_100PPM; Component Kind: Standard; Component Type: Standard; Pin Count: 2; Value: 1k6; Status: Not Recommended; Power: 0.0625W; Tolerance: ±1%; Manufacturer Part Number: R0402_1K6_1%_0.0625W_100PPM; Case: 0402; Mounted: Yes; Sense: No; Socket: No; SMD: Yes; Manufacturer1 Example: YAGEO PHYCOMP; Manufacturer1 ComponentHeight: 0.4mm; HelpURL: \\cern.ch\dfs\Applications\Altium\Datasheets\R0402_Phycomp_RC0402.pdf; Author: CERN DEM JLC; CreateDate: 03.12.2007; LatestRevisionDate: 17.10.2012
R68 = R0603_560K_1%_0.1W_100PPM: Resistor - 1%; Part Description: General Purpose Thick Film Chip Resistor; Manufacturer: GENERIC; Manufacturer1 Part Number: NRC06F5603TRF; Power: 0.1W; TC: ±100ppm/°C; PressFit: No; Part Number: R0603_560K_1%_0.1W_100PPM; Component Kind: Standard; Component Type: Standard; Pin Count: 2; Value: 560k; Status: Preferred; Manufacturer Part Number: R0603_560K_1%_0.1W_100PPM; Case: 0603; Mounted: Yes; Sense: No; Socket: No; SMD: Yes; Manufacturer1 Example: NIC COMPONENT; Manufacturer1 ComponentHeight: 0.55mm; HelpURL: \\cern.ch\dfs\Applications\Altium\Datasheets\R0603_NIC_NRC.pdf; Author: CERN DEM JLC; CreateDate: 03.12.2007; LatestRevisionDate: 13.03.2008
R69 = R0603_150K_1%_0.1W_100PPM: Resistor - 1%; Part Description: General Purpose Thick Film Chip Resistor; Manufacturer: GENERIC; Manufacturer1 Part Number: NRC06F1503TRF; Power: 0.1W; TC: ±100ppm/°C; PressFit: No; Part Number: R0603_150K_1%_0.1W_100PPM; Component Kind: Standard; Component Type: Standard; Pin Count: 2; Value: 150k; Status: Preferred; Manufacturer Part Number: R0603_150K_1%_0.1W_100PPM; Case: 0603; Mounted: Yes; Sense: No; Socket: No; SMD: Yes; Manufacturer1 Example: NIC COMPONENT; Manufacturer1 ComponentHeight: 0.55mm; HelpURL: \\cern.ch\dfs\Applications\Altium\Datasheets\R0603_NIC_NRC.pdf; Author: CERN DEM JLC; CreateDate: 03.12.2007; LatestRevisionDate: 13.03.2008
R154 = R0603_49K9_1%_0.1W_100PPM: Resistor - 1%; Part Description: General Purpose Thick Film Chip Resistor; Manufacturer: GENERIC; Manufacturer1 Part Number: CRCW060349K9FKEA; Power: 0.1W; TC: ±100ppm/°C; PressFit: No; Part Number: R0603_49K9_1%_0.1W_100PPM; Component Kind: Standard; Component Type: Standard; Pin Count: 2; Value: 49k9; Status: Preferred; Manufacturer Part Number: R0603_49K9_1%_0.1W_100PPM; Case: 0603; Mounted: Yes; Sense: No; Socket: No; SMD: Yes; Manufacturer1 Example: VISHAY; Manufacturer1 ComponentHeight: 0.55mm; HelpURL: \\cern.ch\dfs\Applications\Altium\Datasheets\R0603_VISHAY_CRCW e3.pdf; Author: CERN DEM JLC; CreateDate: 16.11.2017; LatestRevisionDate: 16.11.2017
R187 R224 = R0603_10K_1%_0.1W_100PPM: Resistor - 1%; Part Description: General Purpose Thick Film Chip Resistor; Manufacturer: GENERIC; Manufacturer1 Part Number: NRC06F1002TRF; Power: 0.1W; TC: ±100ppm/°C; PressFit: No; Part Number: R0603_10K_1%_0.1W_100PPM; Component Kind: Standard; Component Type: Standard; Pin Count: 2; Value: 10k; Status: Preferred; Tolerance: ±1%; Manufacturer Part Number: R0603_10K_1%_0.1W_100PPM; Case: 0603; Mounted: Yes; Sense: No; Socket: No; SMD: Yes; Manufacturer1 Example: NIC COMPONENT; Manufacturer1 ComponentHeight: 0.55mm; HelpURL: \\cern.ch\dfs\Applications\Altium\Datasheets\R0603_NIC_NRC.pdf; Author: CERN DEM JLC; CreateDate: 03.12.2007; LatestRevisionDate: 13.03.2008
R188 R194 = R0402_0R_JUMPER: Resistor; Part Description: 1A (0.05R Max DC Resistance) Zero Ohm Jumper; Manufacturer: GENERIC; Manufacturer1 Part Number: 232270591001L; Part Number: R0402_0R_JUMPER; Component Kind: Standard; Component Type: Standard; Pin Count: 2; Value: 0; Status: Not recommended; Manufacturer Part Number: R0402_0R_JUMPER; Case: 0402; Mounted: Yes; Sense: No; Socket: No; SMD: Yes; Manufacturer1 Example: YAGEO PHYCOMP; Manufacturer1 ComponentHeight: 0.4mm; HelpURL: \\cern.ch\dfs\Applications\Altium\Datasheets\R0402_Phycomp_RC0402.pdf; Author: CERN DEM JLC; CreateDate: 03.12.2007; LatestRevisionDate: 17.10.2012

## Sheet CPCIS_Connectors_P1_P6.SchDoc: EEM FMC Carrier
size 420 x 297 mm; CheckedBy: -; DrawnBy: Paweł Kulik; Organization: WUT; Address1: Warsaw University of Technology; Address2: Nowowiejska 15/19 00-665 Warsaw; Address3: pawel.kulik@pw.edu.pl; DocumentNumber: 1; SheetNumber: 10; SheetTotal: 12; Projet: ARTIQ/Sinara; CheckedDate: -; Title2: CPCIS Connectors; DivGrp: ISE; Designer: Paweł Kulik; SPICEModelCacheRMUUFYQV: <root> / <DocumentId>RMUUFYQV</DocumentId> / </root>; ModifiedDate: -; Rule: PcbType=ProtelPcb; ProjectName: DIOT_template.PrjPCB
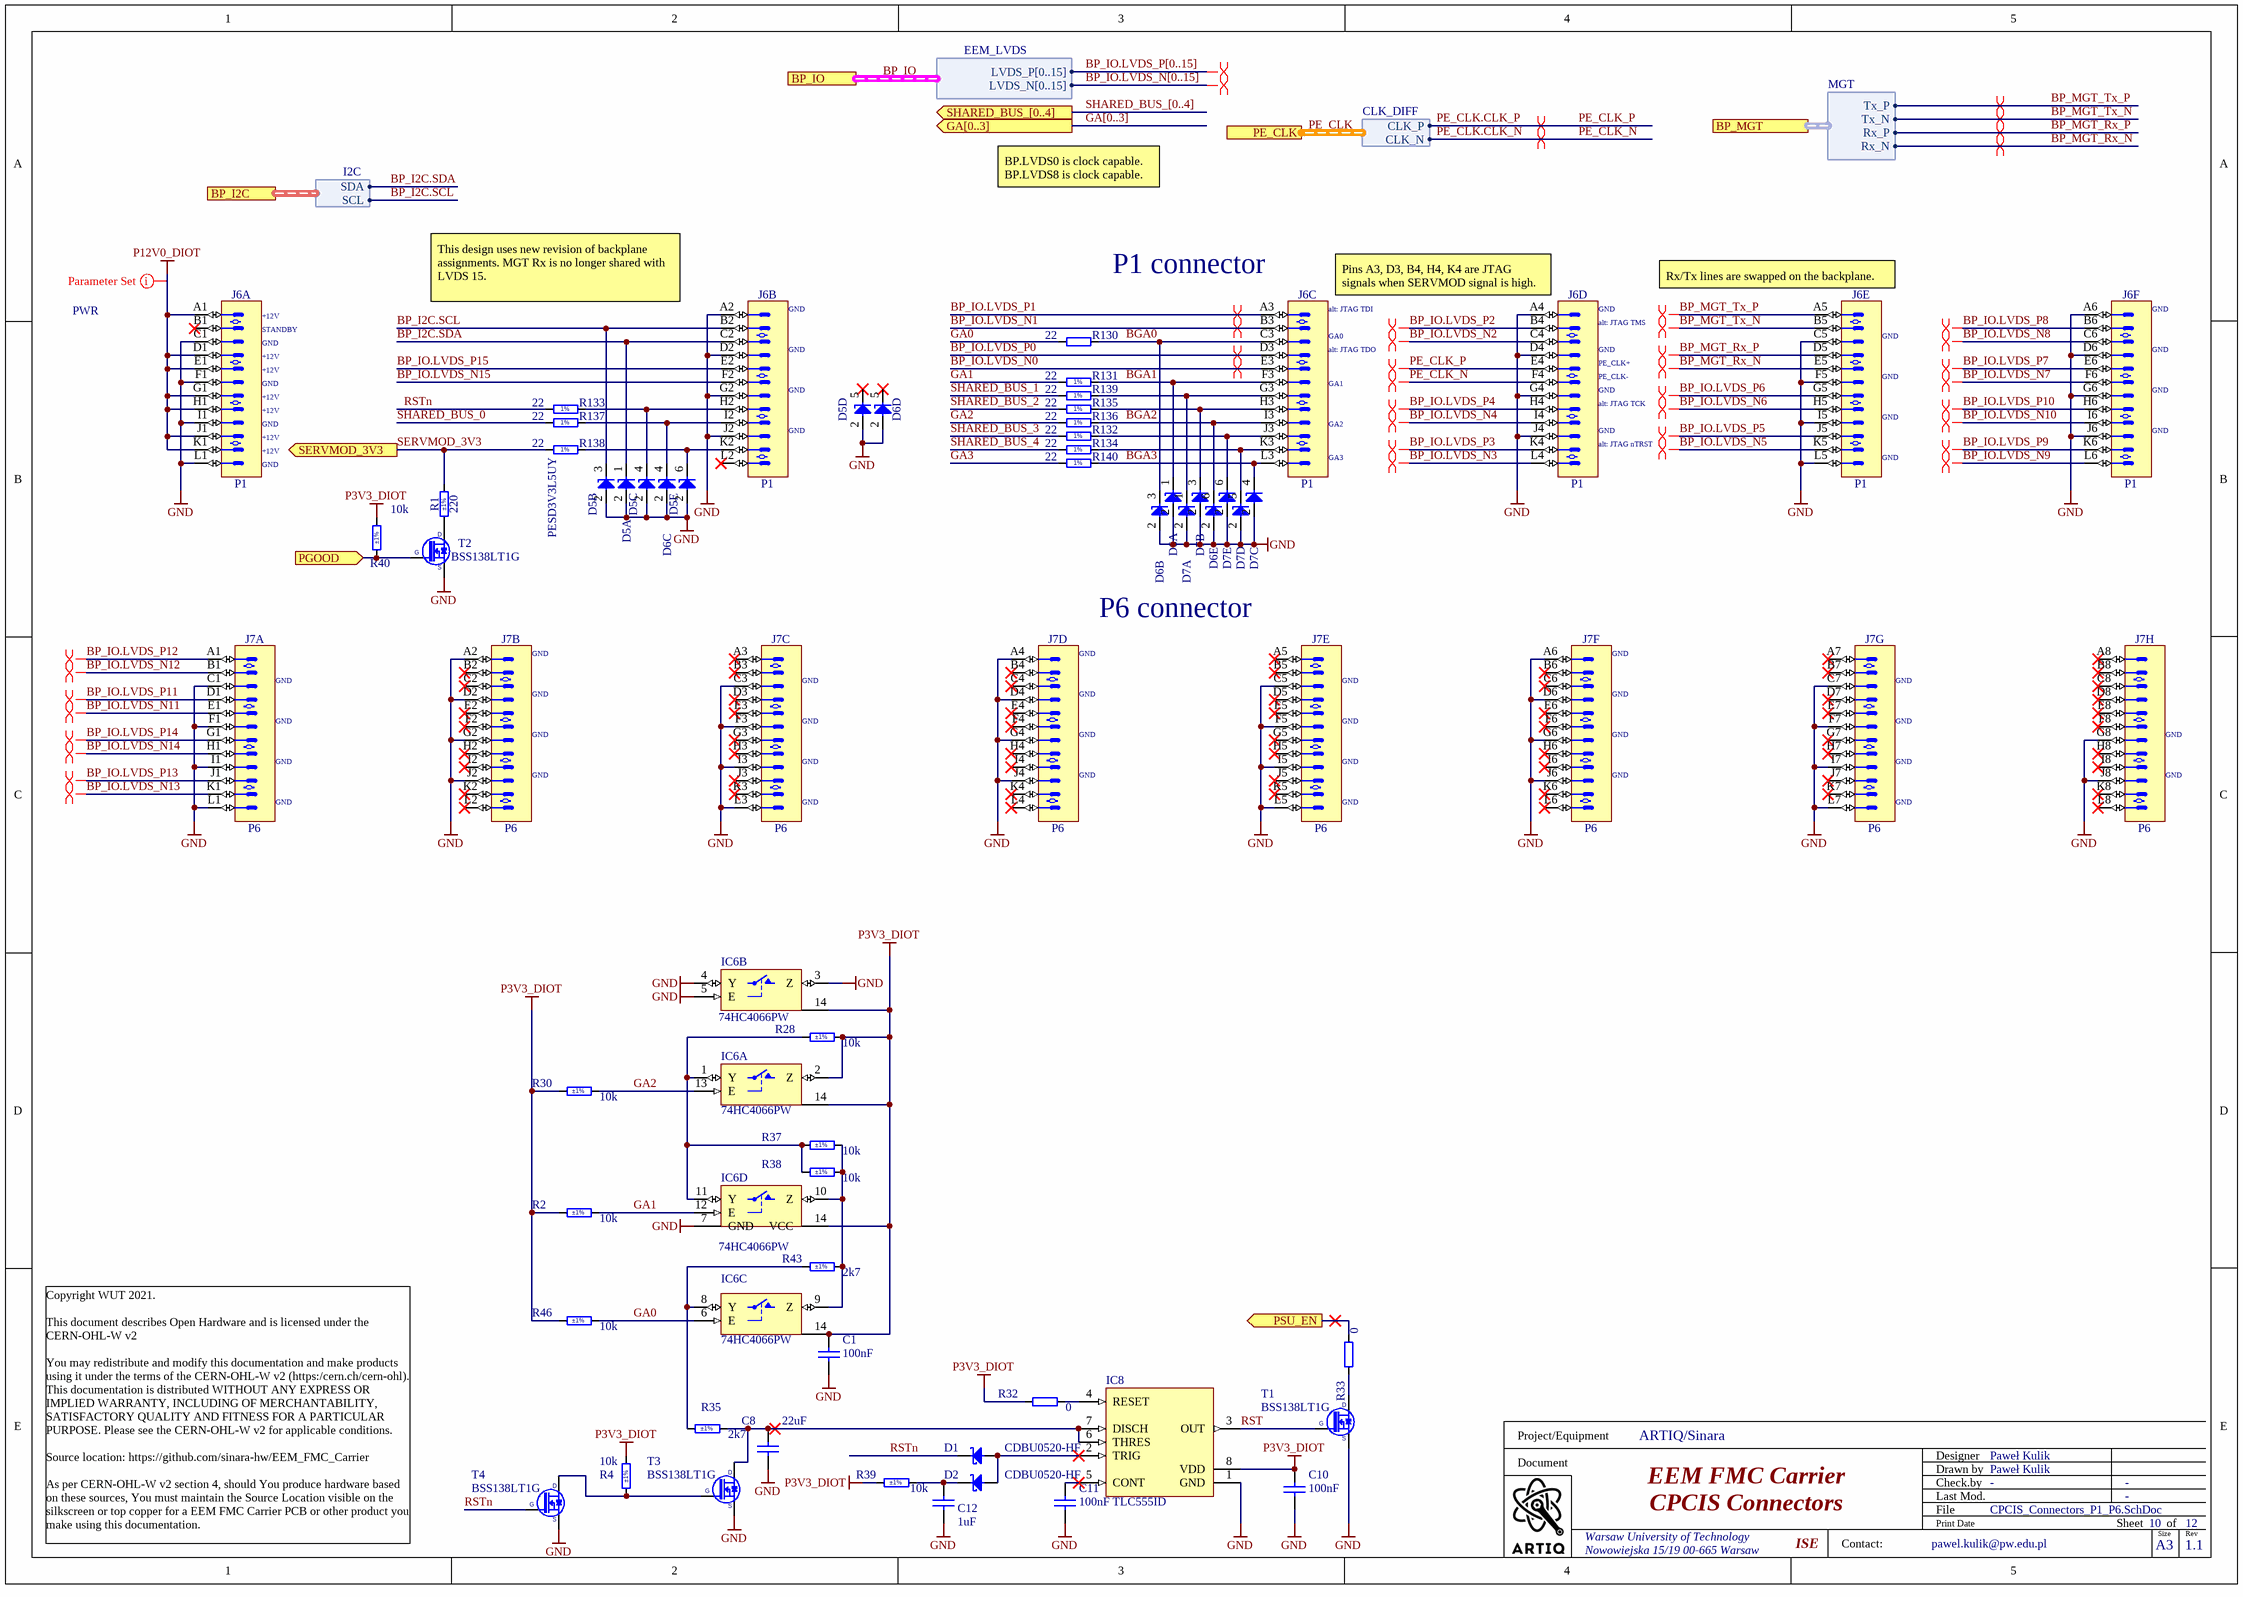
[diagram p2: CPCIS_Connectors_P1_P6.SchDoc]

### Parts
C1  100nF  [CAPC1608X87N]
C8  22uF  [CAPC2012X135N]
C10  100nF  [CAPC1608X87N]
C11  100nF  [CAPC1608X87N]
C12  1uF  [CAPC1608X87N]
D1  CDBU0520-HF  [SOD-523F]
D2  CDBU0520-HF  [SOD-523F]
D5  PESD3V3L5UY  [SOT65P210X110-6N]  (value not drawn)  (parts A,B,C,D,E of 5)
D6  PESD3V3L5UY  [SOT65P210X110-6N]  (value not drawn)  (parts A,B,C,D,E of 5)
D7  PESD3V3L5UY  [SOT65P210X110-6N]  (value not drawn)  (parts A,B,C,D,E of 5)
IC6  74HC4066PW  [SOP65P640X110-14N]  (parts A,B,C,D of 4)
IC8  TLC555ID  [SOIC127P600X175-8N]
J6  P1  [AMPHENOL_10052825-101LF]  (parts A,B,C,D,E,F of 6)
J7  P6  [AMPHENOL_10052838-101LF]  (parts A,B,C,D,E,F,G,H of 8)
R1  220  Tolerance: ±1%  [RESC1005X40N]
R2  10k  Tolerance: ±1%  [RESC1608X55N]
R4  10k  Tolerance: ±1%  [RESC1608X55N]
R28  10k  Tolerance: ±1%  [RESC1608X55N]
R30  10k  Tolerance: ±1%  [RESC1608X55N]
R32  0  [RESC1608X55N]
R33  0  [RESC1608X55N]
R35  2k7  Tolerance: ±1%  [RESC1608X55N]
R37  10k  Tolerance: ±1%  [RESC1608X55N]
R38  10k  Tolerance: ±1%  [RESC1608X55N]
R39  10k  Tolerance: ±1%  [RESC1608X55N]
R40  10k  Tolerance: ±1%  [RESC1608X55N]
R43  2k7  Tolerance: ±1%  [RESC1608X55N]
R46  10k  Tolerance: ±1%  [RESC1608X55N]
R130  22  [RESC1005X40N]
R131  22  [RESC1005X40N]
R132  22  [RESC1005X40N]
R133  22  [RESC1005X40N]
R134  22  [RESC1005X40N]
R135  22  [RESC1005X40N]
R136  22  [RESC1005X40N]
R137  22  [RESC1005X40N]
R138  22  [RESC1005X40N]
R139  22  [RESC1005X40N]
R140  22  [RESC1005X40N]
T1  BSS138LT1G  [SOT95P240X110-3N]
T2  BSS138LT1G  [SOT95P240X110-3N]
T3  BSS138LT1G  [SOT95P240X110-3N]
T4  BSS138LT1G  [SOT95P240X110-3N]

### Ports
BP_I2C (harness I2C), BP_IO (harness EEM_LVDS), BP_MGT (harness MGT), GA[0..3] (out), PE_CLK (harness CLK_DIFF), PGOOD (in), PSU_EN (out), SERVMOD_3V3 (out), SHARED_BUS_[0..4] (out)

### Harnesses
MGT: Tx_P, Tx_N, Rx_P, Rx_N
CLK_DIFF: CLK_N, CLK_P
I2C: SDA, SCL
EEM_LVDS: LVDS_P[0..15], LVDS_N[0..15]

### Nets
GND: C1.1 C8.1 C10.1 C11.1 C12.1 D5.2(A) D6.2(A) D7.2(A) IC6.3(Z) IC6.4(Y) IC6.5(E) IC6.7(GND) IC8.1(GND) J6.A2 J6.A4 J6.A6 J6.C1 J6.C5 J6.D2 J6.D4 J6.D6 J6.F1 J6.F5 J6.G2 J6.G4 J6.G6 J6.I1 J6.I5 J6.J2 J6.J4 J6.J6 J6.L1 J6.L5 J7.A2 J7.A4 J7.A6 J7.C1 J7.C3 J7.C5 J7.C7 J7.D2 J7.D4 J7.D6 J7.F1 J7.F3 J7.F5 J7.F7 J7.G2 J7.G4 J7.G6 J7.G8 J7.I1 J7.I3 J7.I5 J7.I7 J7.J2 J7.J4 J7.J6 J7.J8 J7.L1 J7.L3 J7.L5 J7.L7 T1.2(S) T2.2(S) T3.2(S) T4.2(S)
P3V3_DIOT: C1.2 C10.2 IC6.2(Z) IC6.14(VCC) IC8.8(VDD) R2.1 R4.2 R28.2 R30.1 R32.1 R39.1 R40.2 R46.1
P12V0_DIOT: J6.A1 J6.D1 J6.E1 J6.G1 J6.H1 J6.J1 J6.K1
BGA0: D6.3(C) J6.C3 R130.2
BGA1: D6.1(C) J6.F3 R131.2
BGA2: D6.6(C) J6.I3 R136.2
BGA3: D7.4(C) J6.L3 R140.2
BP_I2C.SCL: D5.3(C) J6.B2 ; port BP_I2C.SCL
BP_I2C.SDA: D5.1(C) J6.C2 ; port BP_I2C.SDA
BP_IO.LVDS_N0: J6.E3
BP_IO.LVDS_N1: J6.B3
BP_IO.LVDS_N2: J6.C4
BP_IO.LVDS_N3: J6.L4
BP_IO.LVDS_N4: J6.I4
BP_IO.LVDS_N5: J6.K5
BP_IO.LVDS_N6: J6.H5
BP_IO.LVDS_N7: J6.F6
BP_IO.LVDS_N8: J6.C6
BP_IO.LVDS_N9: J6.L6
BP_IO.LVDS_N10: J6.I6
BP_IO.LVDS_N11: J7.E1
BP_IO.LVDS_N12: J7.B1
BP_IO.LVDS_N13: J7.K1
BP_IO.LVDS_N14: J7.H1
BP_IO.LVDS_N15: J6.F2
BP_IO.LVDS_P0: J6.D3
BP_IO.LVDS_P1: J6.A3
BP_IO.LVDS_P2: J6.B4
BP_IO.LVDS_P3: J6.K4
BP_IO.LVDS_P4: J6.H4
BP_IO.LVDS_P5: J6.J5
BP_IO.LVDS_P6: J6.G5
BP_IO.LVDS_P7: J6.E6
BP_IO.LVDS_P8: J6.B6
BP_IO.LVDS_P9: J6.K6
BP_IO.LVDS_P10: J6.H6
BP_IO.LVDS_P11: J7.D1
BP_IO.LVDS_P12: J7.A1
BP_IO.LVDS_P13: J7.J1
BP_IO.LVDS_P14: J7.G1
BP_IO.LVDS_P15: J6.E2
BP_MGT_Rx_N: J6.E5 ; port BP_MGT.Rx_N
BP_MGT_Rx_P: J6.D5 ; port BP_MGT.Rx_P
BP_MGT_Tx_N: J6.B5 ; port BP_MGT.Tx_N
BP_MGT_Tx_P: J6.A5 ; port BP_MGT.Tx_P
GA0: IC6.6(E) R46.2 R130.1
GA1: IC6.12(E) R2.2 R131.1
GA2: IC6.13(E) R30.2 R136.1
GA3: R140.1
PE_CLK.CLK_N: J6.F4 ; port PE_CLK.CLK_N  [also labelled PE_CLK_N]
PE_CLK.CLK_P: J6.E4 ; port PE_CLK.CLK_P  [also labelled PE_CLK_P]
PGOOD: R40.1 T2.1(G) ; port PGOOD
PSU_EN: R33.2 ; port PSU_EN
RST: IC8.3(OUT) T1.1(G)
RSTn: D1.1(C) R133.1 T4.1(G)
SERVMOD_3V3: R1.2 R138.1 ; port SERVMOD_3V3
SHARED_BUS_0: R137.1
SHARED_BUS_1: R139.1
SHARED_BUS_2: R135.1
SHARED_BUS_3: R132.1
SHARED_BUS_4: R134.1
NetC8_2: C8.2 IC8.6(THRES) IC8.7(DISCH) R35.2 T3.3(D)
NetC11_2: C11.2 IC8.5(CONT)
NetC12_2: C12.2 D2.1(C) R39.2
NetD1_2: D1.2(A) D2.2(A) IC8.2(TRIG)
NetD5_4: D5.4(C) J6.H2 R133.2
NetD5_6: D5.6(C) J6.K2 R138.2
NetD6_4: D6.4(C) J6.I2 R137.2
NetD7_1: D7.1(C) J6.G3 R139.2
NetD7_3: D7.3(C) J6.H3 R135.2
NetD7_5: D7.5(C) J6.K3 R134.2
NetD7_6: D7.6(C) J6.J3 R132.2
NetIC6_1: IC6.1(Y) IC6.11(Y) R28.1 R37.1 R38.1
NetIC6_8: IC6.8(Y) R35.1 R43.1
NetIC6_9: IC6.9(Z) IC6.10(Z) R37.2 R38.2 R43.2
NetIC8_4: IC8.4(RESET) R32.2
NetR1_1: R1.1 T2.3(D)
NetR4_1: R4.1 T3.1(G) T4.3(D)
NetR33_1: R33.1 T1.3(D)

Not connected (* = marked no-connect by the designer): D5 5(C)*; D6 5(C)*; J6 B1* L2*; J7 A3* A5* A7* A8* B2* B3* B4* B5* B6* B7* B8* C2* C4* C6* C8* D3* D5* D7* D8* E2* E3* E4* E5* E6* E7* E8* F2* F4* F6* F8* G3* G5* G7* H2* H3* H4* H5* H6* H7* H8* I2* I4* I6* I8* J3* J5* J7* K2* K3* K4* K5* K6* K7* K8* L2* L4* L6* L8*

### Buses and harness runs
bus BP_IO.LVDS_N[0..15]
bus BP_IO.LVDS_P[0..15]
bus GA[0..3] = port GA[0..3]
bus SHARED_BUS_[0..4] = port SHARED_BUS_[0..4]
harness BP_IO = port BP_IO
harness PE_CLK = port PE_CLK

### Layout directives
differential pair: (no net found under the mark), BP_IO.LVDS_N0, BP_IO.LVDS_N1, BP_IO.LVDS_N2, BP_IO.LVDS_N3, BP_IO.LVDS_N4, BP_IO.LVDS_N5, BP_IO.LVDS_N6, BP_IO.LVDS_N7, BP_IO.LVDS_N8, BP_IO.LVDS_N9, BP_IO.LVDS_N10, BP_IO.LVDS_N11, BP_IO.LVDS_N12, BP_IO.LVDS_N13, BP_IO.LVDS_N14, BP_IO.LVDS_P0, BP_IO.LVDS_P1, BP_IO.LVDS_P2, BP_IO.LVDS_P3, BP_IO.LVDS_P4, BP_IO.LVDS_P5, BP_IO.LVDS_P6, BP_IO.LVDS_P7, BP_IO.LVDS_P8, BP_IO.LVDS_P9, BP_IO.LVDS_P10, BP_IO.LVDS_P11, BP_IO.LVDS_P12, BP_IO.LVDS_P13, BP_IO.LVDS_P14
differential pair; differential pair class Diff_100Ohm: PE_CLK.CLK_N, PE_CLK.CLK_P
differential pair; differential pair class MGT: BP_MGT_Rx_N, BP_MGT_Rx_P, BP_MGT_Tx_N, BP_MGT_Tx_P
net class PWR: P12V0_DIOT

### Notes on the sheet
- BP.LVDS0 is clock capable.
  BP.LVDS8 is clock capable.
- (near J6) +12V
- This design uses new revision of backplane assignments. MGT Rx is no longer shared with LVDS 15.
- (near J6) GND
- (near J6) P1 connector
- (near J6) alt: JTAG TDI
- (near J6) Pins A3, D3, B4, H4, K4 are JTAG signals when SERVMOD signal is high.
- (near J6) alt: JTAG TMS
- (near J6) Rx/Tx lines are swapped on the backplane.
- (near J6) STANDBY
- GND
- (near J6) alt: JTAG TDO
- (near J6) GA1
- (near J6) GA0
- (near J6) PE_CLK+
- (near J6) PE_CLK-
- (near J6) GA2
- (near J6) GA3
- (near J6) alt: JTAG TCK
- (near J6) alt: JTAG nTRST
- (near J7) GND
- (near J7) P6 connector
- Project/Equipment
- Document
- Designer
- Drawn by
- Check.by
- Copyright WUT 2021.
  This document describes Open Hardware and is licensed under the CERN-OHL-W v2
  You may redistribute and modify this documentation and make products using it under the terms of the CERN-OHL-W v2 (https:/cern.ch/cern-ohl). This documentation is distributed WITHOUT ANY EXPRESS OR IMPLIED WARRANTY, INCLUDING OF MERCHANTABILITY, SATISFACTORY QUALITY AND FITNESS FOR A PARTICULAR PURPOSE. Please see the CERN-OHL-W v2 for applicable conditions.
  Source location: https://github.com/sinara-hw/EEM_FMC_Carrier
  As per CERN-OHL-W v2 section 4, should You produce hardware based on these sources, You must maintain the Source Location visible on the silkscreen or top copper for a EEM FMC Carrier PCB or other product you make using this documentation.
- Contact:
- File
- Last Mod.
- Print Date
- Sheet
- Size
- A3
- of
- Rev
- (in symbol R0402_22R_1%_0.0625W_100PPM) 1%

### Library data of the parts
C1 C10 C11 = CC0603_100NF_50V_10%_X7R: Non-polarised capacitor; Part Description: SMD Multilayer Chip Ceramic Capacitor; Manufacturer: GENERIC; Manufacturer1 Part Number: 223858615649; Voltage: 50V; TC: X7R; Tolerance: ±10%; Part Number: CC0603_100NF_50V_10%_X7R; Component Kind: Standard; Component Type: Standard; Pin Count: 2; Value: 100nF; Status: Preferred; Manufacturer Part Number: CC0603_100NF_50V_10%_X7R; Case: 0603; Mounted: Yes; Socket: No; SMD: Yes; Sense: No; Manufacturer1 Example: PHYCOMP; Manufacturer1 ComponentHeight: 0.87mm; HelpURL: \\cern.ch\dfs\Applications\Altium\Datasheets\CC0603_X7R_PHYCOMP.pdf; Author: CERN DEM JLC; CreateDate: 03.12.2007; LatestRevisionDate: 03.12.2007
C8 = CC0805_22UF_16V_10%_X5R: as C82 on sheet Power_Supplies; Part Number: CC0805_22UF_16V_10%_X5R; Component Kind: Standard; Component Type: Standard; Pin Count: 2; Value: 22uF; Status: Preferred; Manufacturer Part Number: CC0805_22UF_16V_10%_X5R; Case: 0805; Mounted: Yes; Socket: No; SMD: Yes; Sense: No; Manufacturer1 Example: TDK; Manufacturer1 ComponentHeight: 1.35mm; HelpURL: \\cern.ch\dfs\Applications\Altium\Datasheets\CC0805_X5R_TDK_C.pdf; Author: CERN DEM JLC; CreateDate: 25.10.2012; LatestRevisionDate: 25.10.2012
C12 = CC0603_1UF_16V_10%_X7R: Non-polarised capacitor; Part Description: SMD Multilayer Chip Ceramic Capacitor; Manufacturer: GENERIC; Manufacturer1 Part Number: 223878615663; Voltage: 16V; TC: X7R; Tolerance: ±10%; Part Number: CC0603_1UF_16V_10%_X7R; Component Kind: Standard; Component Type: Standard; Pin Count: 2; Value: 1uF; Status: None; Manufacturer Part Number: CC0603_1UF_16V_10%_X7R; Case: 0603; Mounted: Yes; Socket: No; SMD: Yes; Sense: No; Manufacturer1 Example: YAGEO PHYCOMP; Manufacturer1 ComponentHeight: 0.9mm; HelpURL: \\cern.ch\dfs\Applications\Altium\Datasheets\CC0603_X7R_PHYCOMP.pdf; Author: CERN DEM JLC; CreateDate: 03.12.2007; LatestRevisionDate: 17.04.2015
D1 D2 = CDBU0520-HF: Schottky Diode; Part Description: 20V Surface mount Schottky Barrier Diode; Manufacturer: COMCHIP; Voltage: 20V; Power: 500mA; PressFit: No; Bonding: No; Part Number: CDBU0520-HF; Component Kind: Standard; Component Type: Standard; Device: CDBU0520-HF; PackageDescription: Small Outline Diode Flat Lead (SOD-523F), Body; 1.80mm L X 1mm W X 0.85mm H; Manufacturer Part Number: CDBU0520-HF; Pin Count: 2; Case: SOD-523F; Mounted: Yes; Socket: No; SMD: Yes; Sense: No; ComponentHeight: 1mm; HelpURL: \\cern.ch\dfs\Applications\Altium\Datasheets\CDBU0520-HF.pdf; Author: CERN DEM HF; CreateDate: 13.10.2023; LatestRevisionDate: 13.10.2023
D5-D7 = PESD3V3L5UY: Fivefold ESD Protection Diode Arrays; Part Description: Fivefold ESD Protection Diode Arrays (30kV); Manufacturer: NEXPERIA; Voltage: 3.3V; Power: 200W; PressFit: No; Bonding: No; Part Number: PESD3V3L5UY; Component Kind: Standard; Component Type: Standard; Device: PESD3V3L5UY; PackageDescription: SOT363, SC-88, 0.65mm Pitch; 6 Pin, 1.25mm W X 2.00mm L X 1.10mm H body, IPC Medium Density; Manufacturer Part Number: PESD3V3L5UY; Pin Count: 6; Case: SOT363; Mounted: Yes; Socket: No; SMD: Yes; Sense: No; ComponentHeight: 1.1mm; HelpURL: \\cern.ch\dfs\Applications\Altium\Datasheets\PESD3V3L5UY.pdf; Author: CERN DEM WB; CreateDate: 05.07.2021; LatestRevisionDate: 05.07.2021
IC6 = 74HC4066PW: Part Description: Quad Single-Pole Single-Throw Analog Switch; Manufacturer: NXP SEMICONDUCTORS; PressFit: No; Bonding: No; Table: Standard Logic; Part Number: 74HC4066PW; Component Kind: Standard; Component Type: Standard; Device: 74HC4066PW; PackageDescription: SOP, 14-Leads, Body 4.4x5mm (max), Pitch 0.65mm, IPC Medium Density; Manufacturer Part Number: 74HC4066PW; Pin Count: 14; Case: TSSOP14; Mounted: Yes; Socket: No; SMD: Yes; ComponentHeight: 1.1mm; Author: CERN DEM JLC; HelpURL: \\cern.ch\dfs\Applications\Altium\Datasheets\74HC4066PW.pdf; CreateDate: 2014-11-19; LatestRevisionDate: 2014-11-19
IC8 = TLC555ID: LinCMOS Timer; Manufacturer: TEXAS INSTRUMENTS; PressFit: No; Bonding: No; Part Number: TLC555ID; Component Kind: Standard; Component Type: Standard; Device: TLC555ID; PackageDescription: SOIC 8, Pitch 1.27mm, Body 4x5mm, IPC Medium Density; Part Description: LinCMOS Timer; Manufacturer Part Number: TLC555ID; Pin Count: 8; Case: SOIC8; Mounted: Yes; Socket: No; SMD: Yes; Sense: No; ComponentHeight: 1.75mm; Author: CERN DEM JMW; HelpURL: \\cern.ch\dfs\Applications\Altium\Datasheets\TLC555ID.pdf; CreateDate: 23.08.2016; LatestRevisionDate: 23.08.2016
J6 = AMPHENOL_10052825-101LF: 72 Contacts Header, 6 Columns, 4 Pairs per Column; Part Description: 72 Contacts, 2mm Pitch, 6 Columns, 4 Pairs per Column, 4 Walls, Right Angle Header; Part Number: AMPHENOL_10052825-101LF; Component Kind: Standard; Component Type: Standard; Pin Count: 72; Family: AirMax VS; Mounted: Yes; Socket: No; SMD: No; PressFit: Yes; Sense: No; Status: None; Manufacturer: AMPHENOL; Manufacturer Part Number: 10052825-101LF; ComponentHeight: 15.35mm; HelpURL: \\cern.ch\dfs\Applications\Altium\Datasheets\AMPHENOL_10052825-101LF.pdf; ComponentLink1URL: \\cern.ch\dfs\Applications\Altium\Datasheets\AMPHENOL_10052825-101LF_Application.pdf; ComponentLink1Description: Application; Author: CERN DEM MR; CreateDate: 19/02/2018; LatestRevisionDate: 19/02/2018; Classname: Overlapping
J7 = AMPHENOL_10052838-101LF: 96 Contacts Header, 8 Columns, 4 Pairs per Column; Part Description: 96 Contacts, 2mm Pitch, 8 Columns, 4 Pairs per Column, 4 Walls, Right Angle Header; Part Number: AMPHENOL_10052838-101LF; Component Kind: Standard; Component Type: Standard; Pin Count: 96; Family: AirMax VS; Mounted: Yes; Socket: No; SMD: No; PressFit: Yes; Sense: No; Status: None; Manufacturer: AMPHENOL; Manufacturer Part Number: 10052838-101LF; ComponentHeight: 15.35mm; HelpURL: \\cern.ch\dfs\Applications\Altium\Datasheets\AMPHENOL_10052838-101LF.pdf; ComponentLink1URL: \\cern.ch\dfs\Applications\Altium\Datasheets\AMPHENOL_10052838-101LF_Application.pdf; ComponentLink1Description: Application; Author: CERN DEM MR; CreateDate: 19.02.2018; LatestRevisionDate: 19.02.2018
R1 = R0402_220R_1%_0.0625W_100PPM: Resistor - 1%; Part Description: General Purpose Thick Film Chip Resistor; Manufacturer: GENERIC; Manufacturer1 Part Number: 232270672201L; TC: ±100ppm/°C; PressFit: No; Part Number: R0402_220R_1%_0.0625W_100PPM; Component Kind: Standard; Component Type: Standard; Pin Count: 2; Value: 220; Status: Not Recommended; Power: 0.0625W; Manufacturer Part Number: R0402_220R_1%_0.0625W_100PPM; Case: 0402; Mounted: Yes; Sense: No; Socket: No; SMD: Yes; Manufacturer1 Example: YAGEO PHYCOMP; Manufacturer1 ComponentHeight: 0.4mm; HelpURL: \\cern.ch\dfs\Applications\Altium\Datasheets\R0402_Phycomp_RC0402.pdf; Author: CERN DEM JLC; CreateDate: 03.12.2007; LatestRevisionDate: 17.10.2012
R2 R4 R28 R30 R37-R40 R46 = R0603_10K_1%_0.1W_100PPM: as R187 on sheet Power_Supplies; Part Number: R0603_10K_1%_0.1W_100PPM; Component Kind: Standard; Component Type: Standard; Pin Count: 2; Value: 10k; Status: Preferred; Manufacturer Part Number: R0603_10K_1%_0.1W_100PPM; Case: 0603; Mounted: Yes; Sense: No; Socket: No; SMD: Yes; Manufacturer1 Example: NIC COMPONENT; Manufacturer1 ComponentHeight: 0.55mm; HelpURL: \\cern.ch\dfs\Applications\Altium\Datasheets\R0603_NIC_NRC.pdf; Author: CERN DEM JLC; CreateDate: 03.12.2007; LatestRevisionDate: 13.03.2008
R32 R33 = R0603_0R_JUMPER: Resistor; Part Description: 1A (0.05R Max DC Resistance) Zero Ohm Jumper; Manufacturer: GENERIC; Manufacturer1 Part Number: NRC06Z0; PressFit: No; Part Number: R0603_0R_JUMPER; Component Kind: Standard; Component Type: Standard; Pin Count: 2; Value: 0; Status: Preferred; Manufacturer Part Number: R0603_0R_JUMPER; Case: 0603; Mounted: Yes; Sense: No; Socket: No; SMD: Yes; Manufacturer1 Example: NIC COMPONENT; Manufacturer1 ComponentHeight: 0.55mm; HelpURL: \\cern.ch\dfs\Applications\Altium\Datasheets\R0603_NIC_NRC.pdf; Author: CERN DEM JLC; CreateDate: 03.12.2007; LatestRevisionDate: 13.03.2008
R35 R43 = R0603_2K7_1%_0.1W_100PPM: Resistor - 1%; Part Description: General Purpose Thick Film Chip Resistor; Manufacturer: GENERIC; Manufacturer1 Part Number: RC0603FR-072K7L; Power: 0.1W; TC: ±100ppm/°C; PressFit: No; Part Number: R0603_2K7_1%_0.1W_100PPM; Component Kind: Standard; Component Type: Standard; Pin Count: 2; Value: 2k7; Status: Preferred; Manufacturer Part Number: R0603_2K7_1%_0.1W_100PPM; Case: 0603; Mounted: Yes; Sense: No; Socket: No; SMD: Yes; Manufacturer1 Example: YAGEO PHYCOMP; Manufacturer1 ComponentHeight: 0.55mm; HelpURL: \\cern.ch\dfs\Applications\Altium\Datasheets\R0603_PHYCOMP_RC0603.pdf; Author: CERN DEM JLC; CreateDate: 02.05.2011; LatestRevisionDate: 02.05.2011
R130-R140 = R0402_22R_1%_0.0625W_100PPM: Resistor - 1%; Part Description: General Purpose Thick Film Chip Resistor; Manufacturer: GENERIC; Manufacturer1 Part Number: 232270672209L; PressFit: No; Part Number: R0402_22R_1%_0.0625W_100PPM; Component Kind: Standard; Component Type: Standard; Pin Count: 2; Value: 22; Status: Not Recommended; Power: 0.0625W; Tolerance: ±1%; Manufacturer Part Number: R0402_22R_1%_0.0625W_100PPM; Case: 0402; Mounted: Yes; Socket: No; SMD: Yes; Manufacturer1 Example: YAGEO PHYCOMP; Manufacturer1 ComponentHeight: 0.4mm; HelpURL: \\cern.ch\dfs\Applications\Altium\Datasheets\R0402_Phycomp_RC0402.pdf; Author: CERN DEM JLC; CreateDate: 03.12.2007; LatestRevisionDate: 17.10.2012; Sense: No
T1-T4 = BSS138LT1G: N-CHANNEL MOSFET WITH DIODE; Part Description: 50V, 200mA N-Channel Enhancement Mode Field-Effect Transistor; Manufacturer: ON SEMICONDUCTOR; PressFit: No; Bonding: No; Part Number: BSS138LT1G; Component Kind: Standard; Component Type: Standard; Device: BSS138LT1G; PackageDescription: SOT23, 0.95mm Pitch; 3 Pin, 1.40mm W X 3.00mm L X 1.10mm H body, IPC Medium Density; Manufacturer Part Number: BSS138L; Pin Count: 3; Case: SOT23-3; Mounted: Yes; Socket: No; SMD: Yes; Sense: No; ComponentHeight: 1.11mm; HelpURL: \\cern.ch\dfs\Applications\Altium\Datasheets\BSS138LT1G.pdf; Author: CERN DEM JLC; CreateDate: 23.03.2009; LatestRevisionDate: 25.05.2022